# Altium schematic sheet Sheet1.SchDoc
size A4
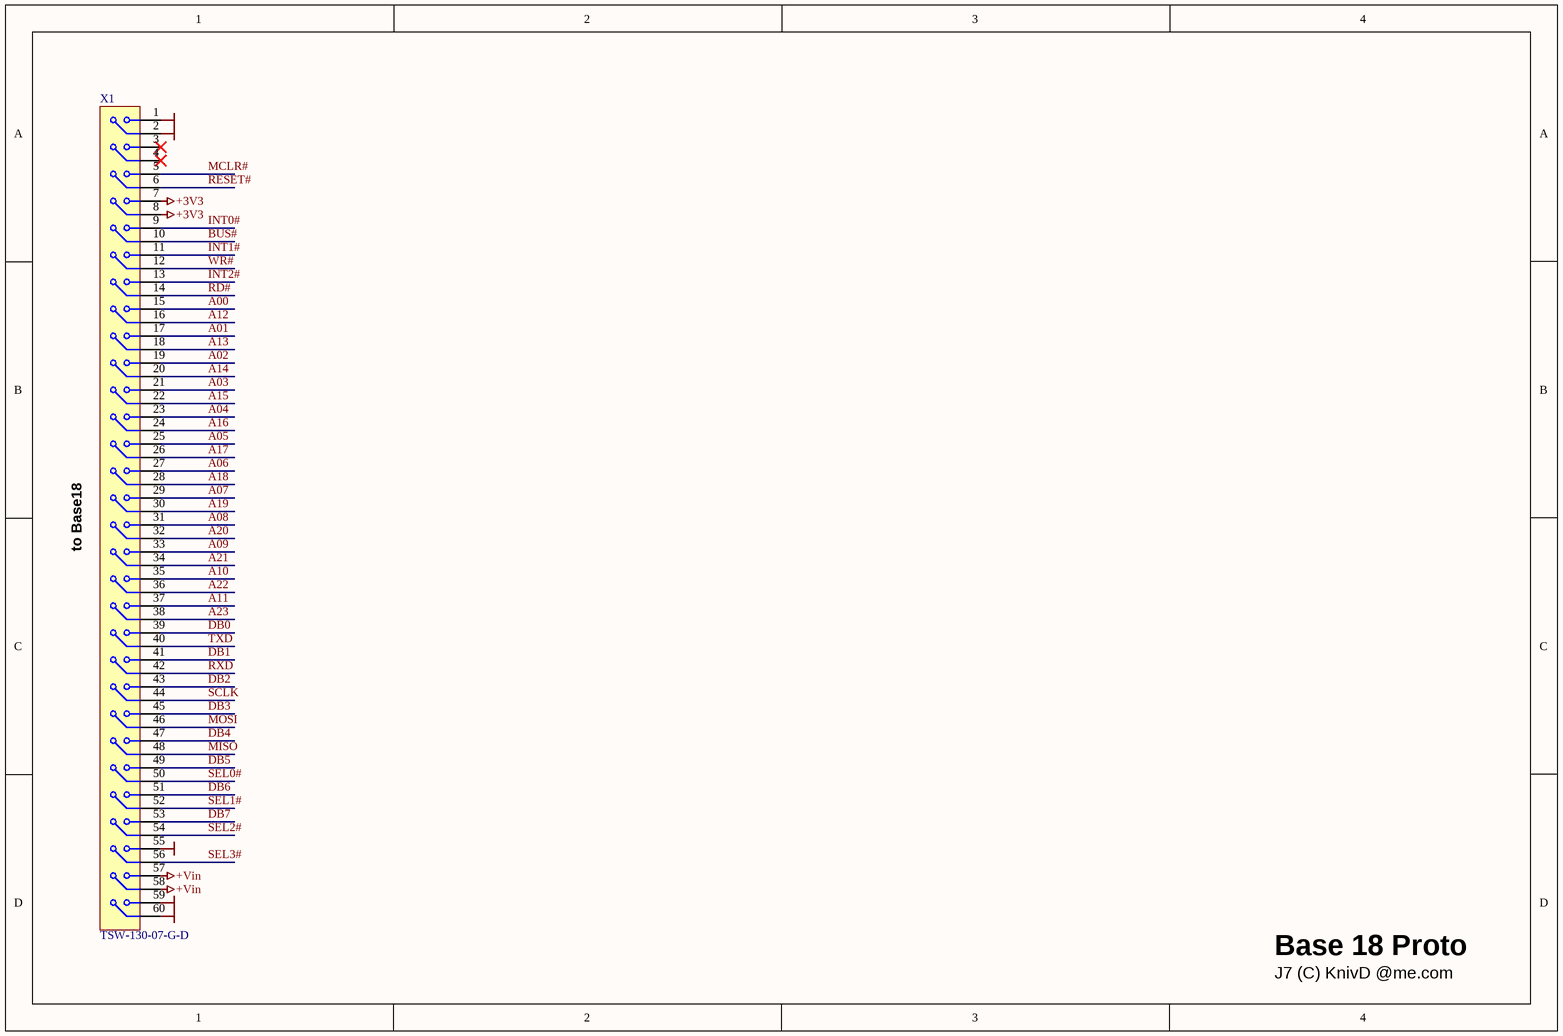
[diagram p0: Sheet1.SchDoc]

## Parts
X1  TSW-130-07-G-D  [DIL60-M-EDGE]

## Nets
+3V3: X1.7 X1.8
+Vin: X1.57 X1.58
GND: X1.1 X1.2 X1.55 X1.59 X1.60
A00: X1.15
A01: X1.17
A02: X1.19
A03: X1.21
A04: X1.23
A05: X1.25
A06: X1.27
A07: X1.29
A08: X1.31
A09: X1.33
A10: X1.35
A11: X1.37
A12: X1.16
A13: X1.18
A14: X1.20
A15: X1.22
A16: X1.24
A17: X1.26
A18: X1.28
A19: X1.30
A20: X1.32
A21: X1.34
A22: X1.36
A23: X1.38
BUS#: X1.10
DB0: X1.39
DB1: X1.41
DB2: X1.43
DB3: X1.45
DB4: X1.47
DB5: X1.49
DB6: X1.51
DB7: X1.53
INT0#: X1.9
INT1#: X1.11
INT2#: X1.13
MCLR#: X1.5
MISO: X1.48
MOSI: X1.46
RD#: X1.14
RESET#: X1.6
RXD: X1.42
SCLK: X1.44
SEL0#: X1.50
SEL1#: X1.52
SEL2#: X1.54
SEL3#: X1.56
TXD: X1.40
WR#: X1.12

Not connected (* = marked no-connect by the designer): X1 3* 4*

## Notes on the sheet
- to Base18
- Base 18 Proto
- J7 (C) KnivD @me.com

## Library data of the parts
X1 = Connector 2x30: Dual row, 60-way connector